# EAGLE board ACB Jr. (EAGLE 8.6.3), part 1 of 2
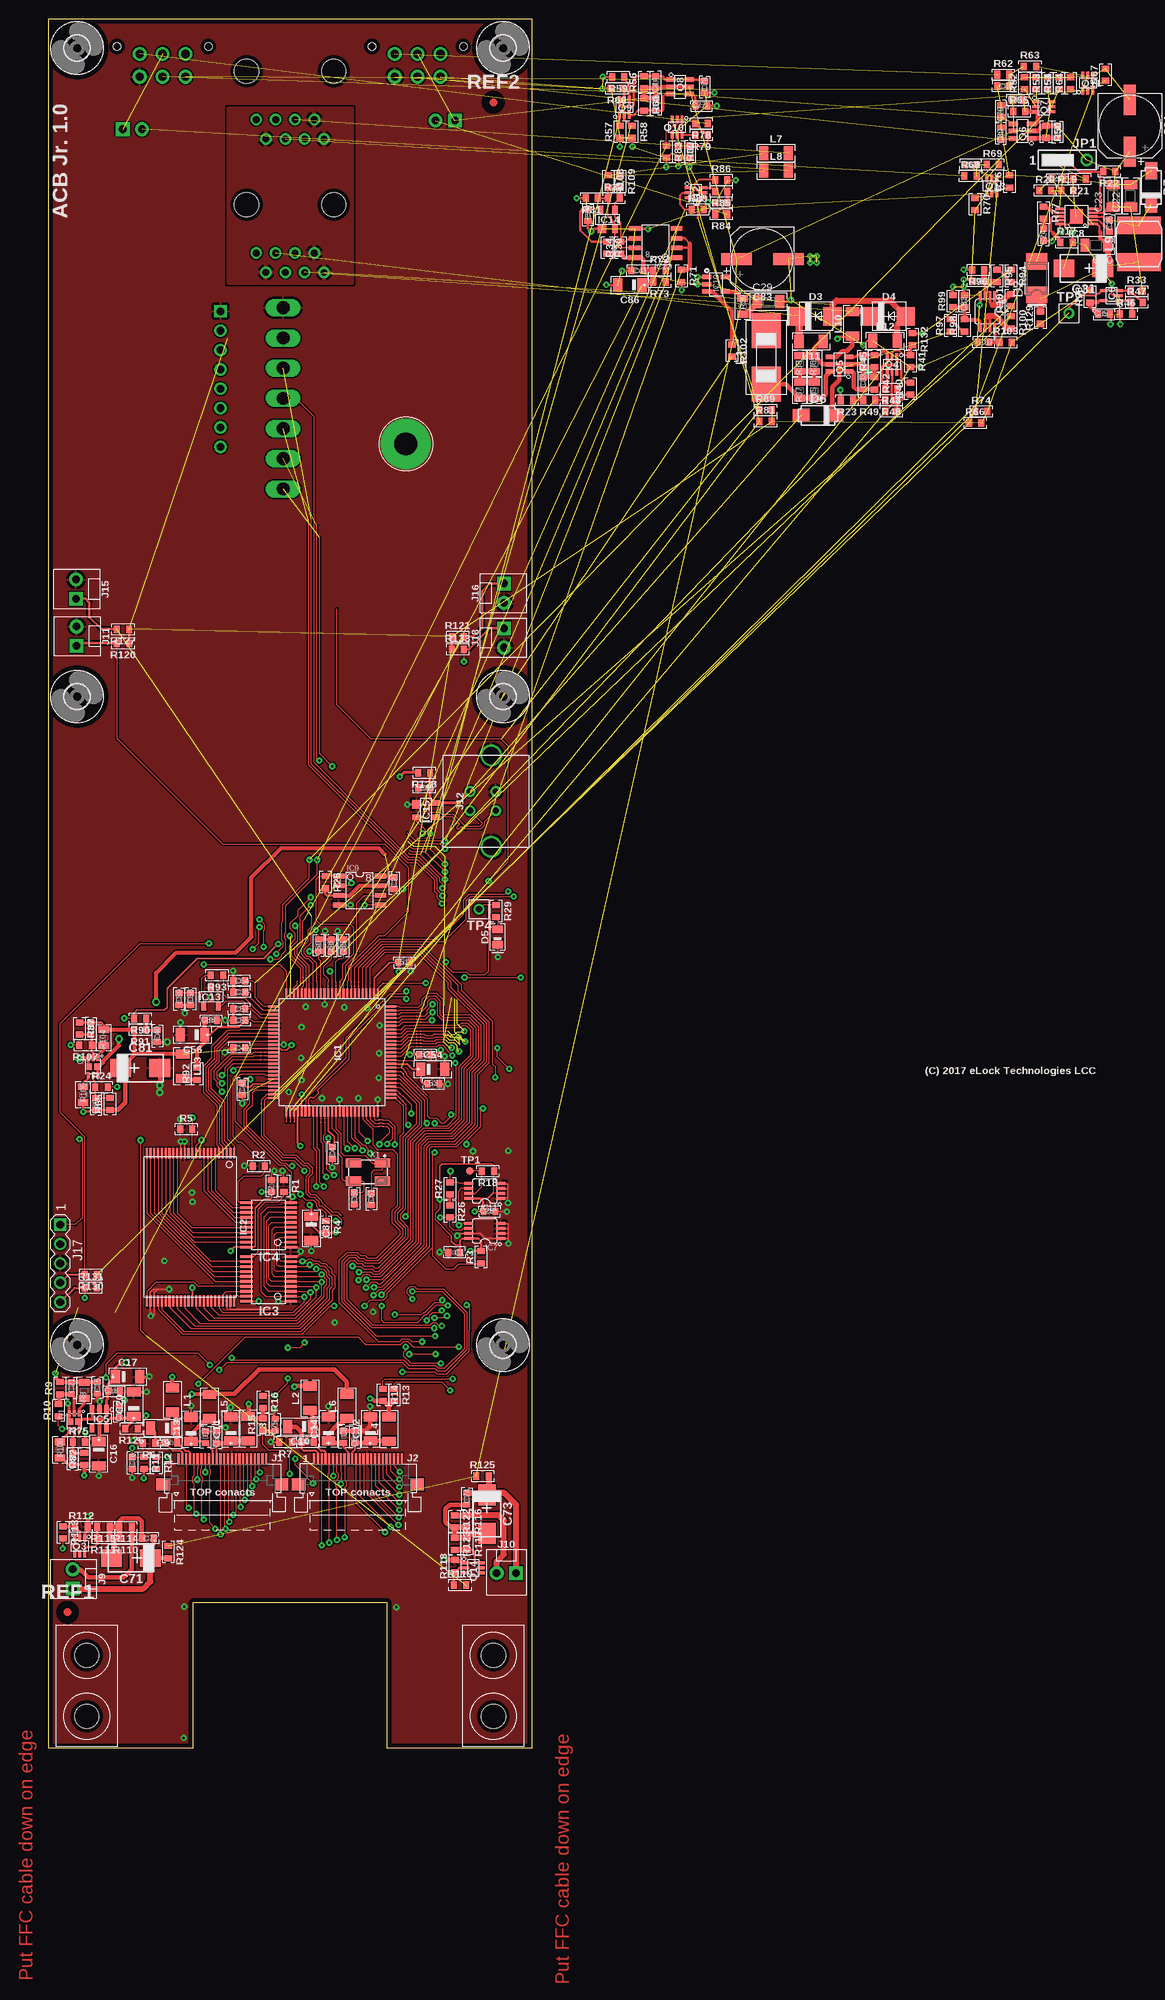
[diagram p6: board, top side]
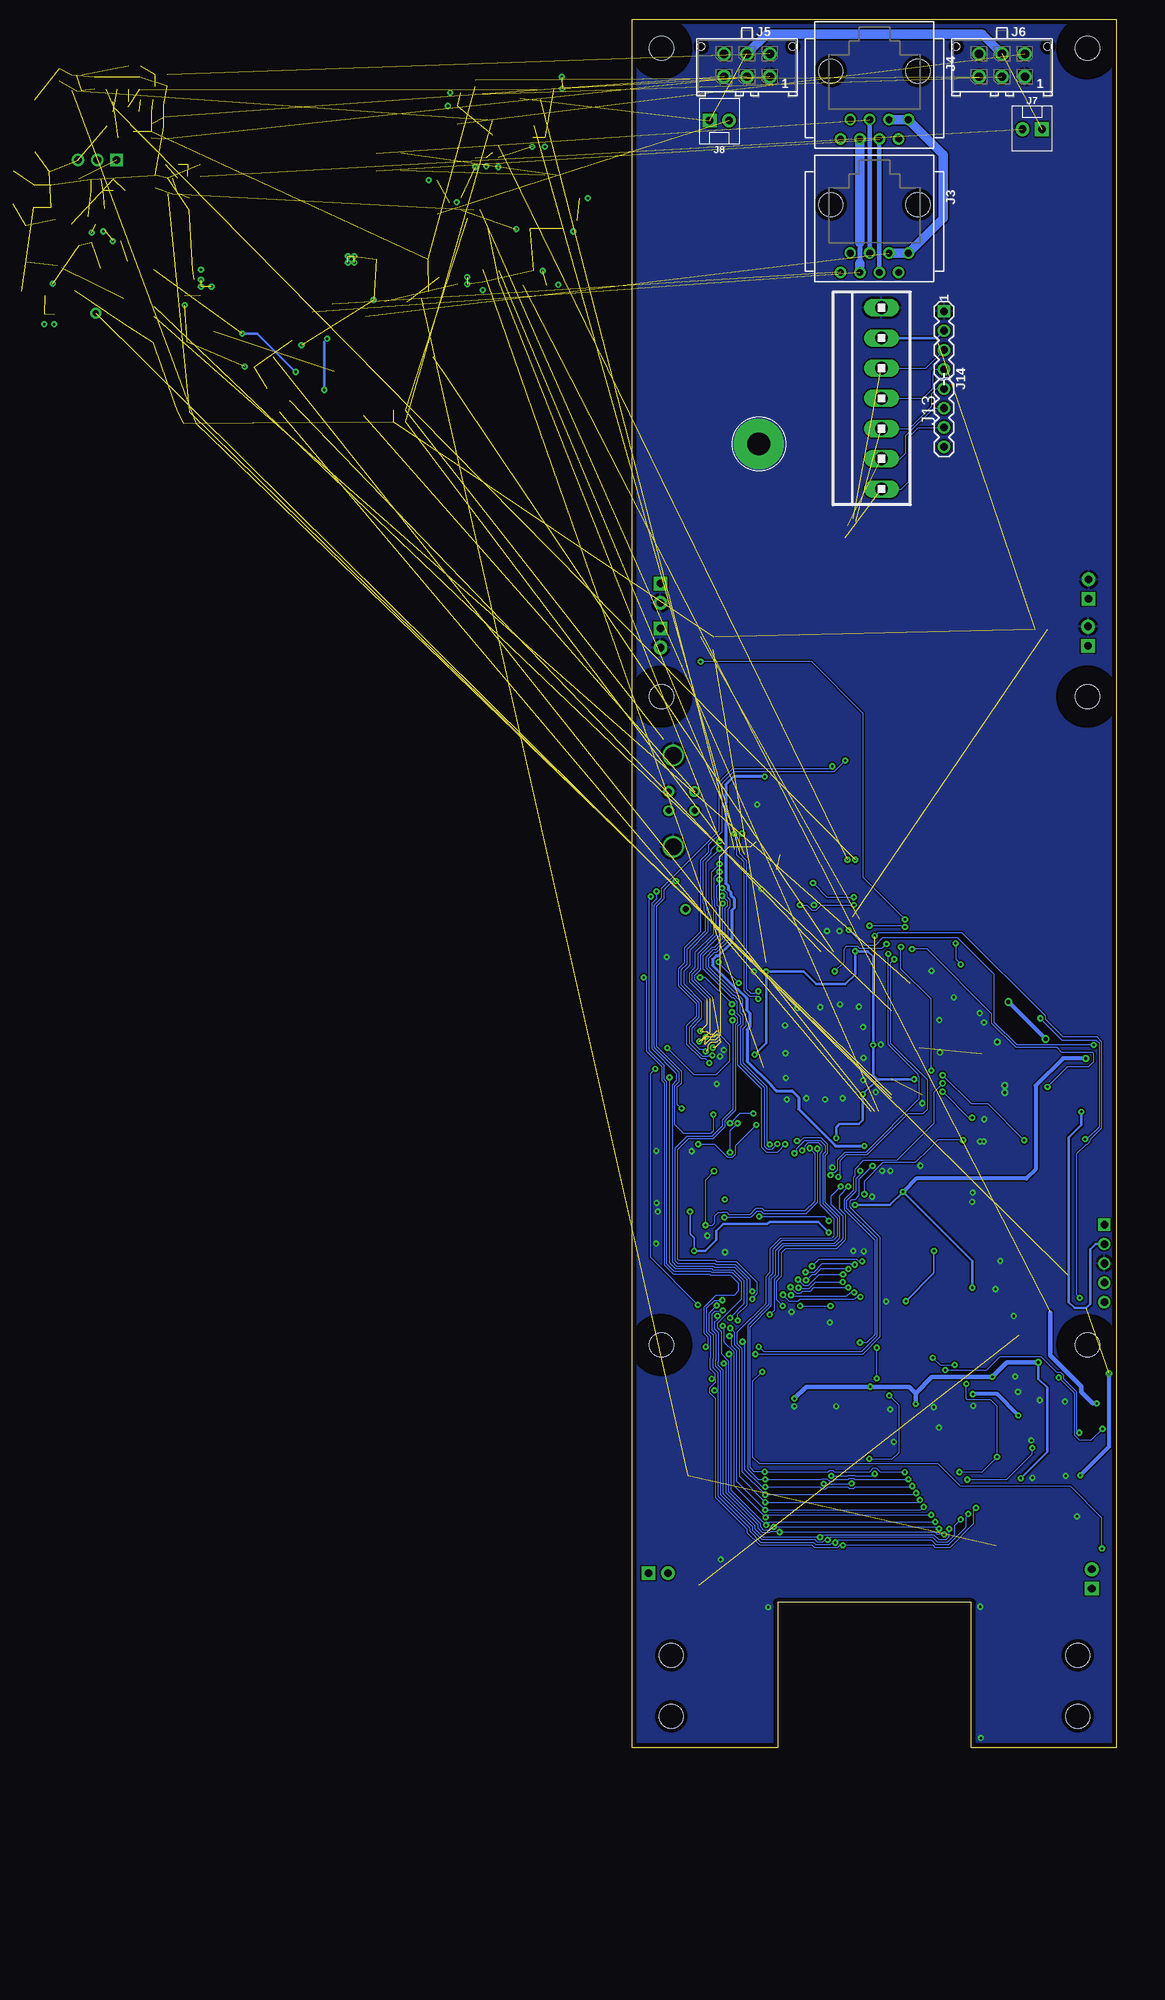
[diagram p7: board, bottom side, seen from below]

Size 63.5 x 226.82 mm. Coordinates in mm from the lower left corner, seen from the top.
Outline: 63.5,0 63.5,226.82 0,226.82 0,0 19.05,0 19.05,19.05 44.45,19.05 44.45,0 63.5,0
Copper layers (1*16): Top 0.035mm / dielectric 1.5mm / Bottom 0.035mm
Design rules "default *": minimum track width 6mil, minimum drill 0.3mm, track to track 0.2mm, track to pad 0.2mm, pad to pad 0.2mm, via to via 0.2mm, smd to smd 0.001mm, copper to edge 0.5mm, drill to drill 0.2mm, minimum pad ring 0.3mm, minimum via ring 0.25mm, stop-mask expansion 0.1mm, vias tented up to drill 0.6mm, thermal gap 0.35mm
Net classes: 1 HV: clearance 0.3 mm to class 0
tKeepout: area 16.6,19.1 to 46.9,32.5; 2 lines
tRestrict: 34 lines

## Footprints (pad centres in the part's own frame; a part is rotated, then mirrored left to right if it is on the bottom)
0603 = smd 0.762 x 0.965: 1 -0.787,0; 2 0.787,0
1206-POL-C = smd 1.19 x 1.79: + -1.6,0; - 1.6,0
1206 = smd 1.143 x 1.702: 1 -1.473,0; 2 1.473,0
CT-C = smd 2.743 x 2.311: + -2.54,0; - 2.54,0
CAP_8MM_DIA_SMT = smd 1.59 x 3.99: 1 0,3.4; 2 0,-3.4
SMA = smd 2.159 x 2.743: + -2.311,0.003; - 2.108,-0.002
SMB@1 = smd 2.4 x 2.4: A 2.2,0; C -2.2,0
0805-POL-D = smd 0.99 x 1.39: A 1,0; K -1,0
SMA' = smd 2.21 x 1.575: A -2.223,0; K 2.223,0
LITTLEFUSE0154 = smd 4.6 x 3.8: 1 3.5,0; 2 -3.5,0
CAM-HOLDER = hole 3.2: 0,4; 0,-4
3,2 = hole 3.2: 0,0
TQFP100_14X14_0,5MM = smd 1.39 x 0.28: 1 -7.7,6; 2 -7.7,5.5; 3 -7.7,5; 4 -7.7,4.5; 5 -7.7,4; 6 -7.7,3.5; 7 -7.7,3; 8 -7.7,2.5; 9 -7.7,2; 10 -7.7,1.5; 11 -7.7,1; 12 -7.7,0.5; 13 -7.7,0; 14 -7.7,-0.5; 15 -7.7,-1; 16 -7.7,-1.5; 17 -7.7,-2; 18 -7.7,-2.5; 19 -7.7,-3; 20 -7.7,-3.5; 21 -7.7,-4; 22 -7.7,-4.5; 23 -7.7,-5; 24 -7.7,-5.5; 25 -7.7,-6; 51 7.7,-6; 52 7.7,-5.5; 53 7.7,-5; 54 7.7,-4.5; 55 7.7,-4; 56 7.7,-3.5; 57 7.7,-3; 58 7.7,-2.5; 59 7.7,-2; 60 7.7,-1.5; 61 7.7,-1; 62 7.7,-0.5; 63 7.7,0; 64 7.7,0.5; 65 7.7,1; 66 7.7,1.5; 67 7.7,2; 68 7.7,2.5; 69 7.7,3; 70 7.7,3.5; 71 7.7,4; 72 7.7,4.5; 73 7.7,5; 74 7.7,5.5; 75 7.7,6 | smd 0.28 x 1.39: 26 -6,-7.7; 27 -5.5,-7.7; 28 -5,-7.7; 29 -4.5,-7.7; 30 -4,-7.7; 31 -3.5,-7.7; 32 -3,-7.7; 33 -2.5,-7.7; 34 -2,-7.7; 35 -1.5,-7.7; 36 -1,-7.7; 37 -0.5,-7.7; 38 0,-7.7; 39 0.5,-7.7; 40 1,-7.7; 41 1.5,-7.7; 42 2,-7.7; 43 2.5,-7.7; 44 3,-7.7; 45 3.5,-7.7; 46 4,-7.7; 47 4.5,-7.7; 48 5,-7.7; 49 5.5,-7.7; 50 6,-7.7; 76 6,7.7; 77 5.5,7.7; 78 5,7.7; 79 4.5,7.7; 80 4,7.7; 81 3.5,7.7; 82 3,7.7; 83 2.5,7.7; 84 2,7.7; 85 1.5,7.7; 86 1,7.7; 87 0.5,7.7; 88 0,7.7; 89 -0.5,7.7; 90 -1,7.7; 91 -1.5,7.7; 92 -2,7.7; 93 -2.5,7.7; 94 -3,7.7; 95 -3.5,7.7; 96 -4,7.7; 97 -4.5,7.7; 98 -5,7.7; 99 -5.5,7.7; 100 -6,7.7
48-TSOP-I = smd 1.4 x 0.28: 1 -9.7,5.75; 2 -9.7,5.25; 3 -9.7,4.75; 4 -9.7,4.25; 5 -9.7,3.75; 6 -9.7,3.25; 7 -9.7,2.75; 8 -9.7,2.25; 9 -9.7,1.75; 10 -9.7,1.25; 11 -9.7,0.75; 12 -9.7,0.25; 13 -9.7,-0.25; 14 -9.7,-0.75; 15 -9.7,-1.25; 16 -9.7,-1.75; 17 -9.7,-2.25; 18 -9.7,-2.75; 19 -9.7,-3.25; 20 -9.7,-3.75; 21 -9.7,-4.25; 22 -9.7,-4.75; 23 -9.7,-5.25; 24 -9.7,-5.75; 25 9.7,-5.75; 26 9.7,-5.25; 27 9.7,-4.75; 28 9.7,-4.25; 29 9.7,-3.75; 30 9.7,-3.25; 31 9.7,-2.75; 32 9.7,-2.25; 33 9.7,-1.75; 34 9.7,-1.25; 35 9.7,-0.75; 36 9.7,-0.25; 37 9.7,0.25; 38 9.7,0.75; 39 9.7,1.25; 40 9.7,1.75; 41 9.7,2.25; 42 9.7,2.75; 43 9.7,3.25; 44 9.7,3.75; 45 9.7,4.25; 46 9.7,4.75; 47 9.7,5.25; 48 9.7,5.75
TSSOP20 = smd 1.6 x 0.35: 1 -2.9,2.925; 2 -2.9,2.275; 3 -2.9,1.625; 4 -2.9,0.975; 5 -2.9,0.325; 6 -2.9,-0.325; 7 -2.9,-0.975; 8 -2.9,-1.625; 9 -2.9,-2.275; 10 -2.9,-2.925; 11 2.9,-2.925; 12 2.9,-2.275; 13 2.9,-1.625; 14 2.9,-0.975; 15 2.9,-0.325; 16 2.9,0.325; 17 2.9,0.975; 18 2.9,1.625; 19 2.9,2.275; 20 2.9,2.925
SOT23-5 = smd 0.59 x 1.19: 1 -0.95,-1.2; 2 0,-1.2; 3 0.95,-1.2; 4 0.95,1.2; 5 -0.95,1.2
SC-70-5 = smd 0.39 x 0.99: 1 -0.65,-1; 2 0,-1; 3 0.65,-1; 4 0.65,1; 5 -0.65,1
MSOP-08 = smd 0.38 x 1.2: 1 -1,-2.1; 2 -0.35,-2.1; 3 0.3,-2.1; 4 0.95,-2.1; 5 0.95,2.1; 6 0.3,2.1; 7 -0.35,2.1; 8 -1,2.1
MSOP10EXP = smd 0.3 x 1.2: 1 -1,-2.2; 2 -0.5,-2.2; 3 0,-2.2; 4 0.5,-2.2; 5 1,-2.2; 6 1,2.2; 7 0.5,2.2; 8 0,2.2; 9 -0.5,2.2; 10 -1,2.2 | smd 1.88 x 1.68: EP 0,0
SO-08 = smd 0.61 x 1.524: 1 -1.905,-2.743; 2 -0.635,-2.743; 3 0.635,-2.743; 4 1.905,-2.743; 5 1.905,2.743; 6 0.635,2.743; 7 -0.635,2.743; 8 -1.905,2.743
SOT23-5' = smd 0.6 x 1.2: 1 -0.95,-1.206; 2 0,-1.206; 3 0.95,-1.206; 4 0.95,1.206; 5 -0.95,1.206
SO08 = smd 0.61 x 1.524: 1 -1.905,-2.743; 2 -0.635,-2.743; 3 0.635,-2.743; 4 1.905,-2.743; 5 1.905,2.743; 6 0.635,2.743; 7 -0.635,2.743; 8 -1.905,2.743
SOT23 = smd 0.69 x 1.19: 1 0.95,1.2; 2 -0.95,1.2; 3 0,-1.2
SOT-143 = smd 1.09 x 1.19: 1 -0.75,-1.2 | smd 0.69 x 1.19: 2 0.95,-1.2; 3 0.95,1.2; 4 -0.95,1.2
FH12A-24S-05SH = smd 0.3 x 1.5: 1 -5.75,2.8; 2 -5.25,2.8; 3 -4.75,2.8; 4 -4.25,2.8; 5 -3.75,2.8; 6 -3.25,2.8; 7 -2.75,2.8; 8 -2.25,2.8; 9 -1.75,2.8; 10 -1.25,2.8; 11 -0.75,2.8; 12 -0.25,2.8; 13 0.25,2.8; 14 0.75,2.8; 15 1.25,2.8; 16 1.75,2.8; 17 2.25,2.8; 18 2.75,2.8; 19 3.25,2.8; 20 3.75,2.8; 21 4.25,2.8; 22 4.75,2.8; 23 5.25,2.8; 24 5.75,2.8 | smd 1.8 x 1.6: C1 -7.75,-0.5; C2 7.75,-0.5
RJ8-8-180 = drill 0.9 pad 1.4: 1 -4.445,6.35; 2 -3.175,8.89; 3 -1.905,6.35; 4 -0.635,8.89; 5 0.635,6.35; 6 1.905,8.89; 7 3.175,6.35; 8 4.445,8.89 | hole 3.2: 5.715,0; -5.715,0
MOLEX430450613 = drill 1.1 pad 1.8: 1 3,-1.5; 2 0,-1.5; 3 -3,-1.5; 4 3,1.5; 5 0,1.5; 6 -3,1.5 | hole 1: 6,2.45; -6,2.45
3-641215-2 = drill 1 pad 1.8 square: 1 1.27,0 | drill 1 pad 1.8: 2 -1.27,0
USB_B_180 = drill 0.8 pad 1.4: 1_+5V 1.25,2.8; 2_D- -1.25,2.8; 3_D+ -1.25,-0.6; 4_GND 1.25,-0.6 | drill 2.2 pad 2.8: SH1 -6,0; SH2 6,0
1X7MTA = drill 1.676 long: 1 11.887,0; 2 7.925,0; 3 3.962,0; 4 0,0; 5 -3.962,0; 6 -7.925,0; 7 -11.887,0
MA08-1-MALE = drill 1 pad 1.6 square: 1 -8.89,0 | drill 1 pad 1.6: 2 -6.35,0; 3 -3.81,0; 4 -1.27,0; 5 1.27,0; 6 3.81,0; 7 6.35,0; 8 8.89,0
MA05-1 = drill 1 pad 1.6 square: 1 -5.08,0 | drill 1 pad 1.6: 2 -2.54,0; 3 0,0; 4 2.54,0; 5 5.08,0
JP3CLOSE12 = drill 1 pad 1.626 square: 1 -2.54,0 | drill 1 pad 1.626: 2 0,0; 3 2.54,0
1206@1 = smd 1.19 x 1.79: 1 -1.6,0; 2 1.6,0
NR6028 = smd 2.3 x 5.7: 1 2.4,0; 2 -2.4,0
TEMP-PAD = smd 0.2 x 0.2: P$1 0,0
BT_MODULE_BRD = drill 3 pad 6.6: 1 25.5,20.5
MICRO_FET = smd 0.4 x 0.8: 1 -0.65,-1.1; 2 0,-1.1; 3 0.65,-1.1; 4 0.65,1.1; 5 0,1.1; 6 -0.65,1.1 | smd 0.7 x 0.86: P1 -0.5,0; P2 0.5,0
SC70-6 = smd 0.39 x 0.99: 1 -0.65,-1; 2 0,-1; 3 0.65,-1; 4 0.65,1; 5 0,1; 6 -0.65,1
SSOT-6 = smd 0.6 x 1.2: 1 -0.95,-1.2; 2 0,-1.2; 3 0.95,-1.206; 4 0.95,1.2; 5 0,1.2; 6 -0.95,1.2
0603@1 = smd 0.79 x 0.99: 1 -0.8,0; 2 0.8,0
0805 = smd 0.9 x 1.4: 1 -1.04,0; 2 1.04,0
SMD_ROUND_1MM = smd 1 x 1: P$1 0,0
TH_ROUND_14MM08MM = drill 0.8 pad 1.4: P$1 0,0
7B = smd 2 x 1.2: 1 -1.9,-1.2; 2 1.9,-1.2; 3 1.9,1.2; 4 -1.9,1.2

## Placement (x,y rotation side)
C1  100n  [0603]  53.3,64.97 180 top
C2  100n  [0603]  29.33,73.72 90 top
C3  100n  [0603]  16.15,40.02 0 top
C4  100n  [0603]  34.08,40.11 0 top
C5  100n  [0603]  22.1,40.72 90 top
C6  100n  [0603]  40.28,40.78 90 top
C7  100n  [0603]  20.63,40.76 270 top
C8  100n  [0603]  38.77,40.78 270 top
C9  10uTA  [1206-POL-C]  15.08,41.92 180 top
C10  10uTA  [1206-POL-C]  33.04,42.12 180 top
C11  10uTA  [1206-POL-C]  23.98,41.83 90 top
C12  10uTA  [1206-POL-C]  42.28,41.83 90 top
C13  10uTA  [1206-POL-C]  18.75,41.77 90 top
C14  10uTA  [1206-POL-C]  36.79,41.83 90 top
C15  10u  [0603]  6.44,47.24 270 top
C16  10uTA  [1206-POL-C]  6.64,38.56 270 top
C17  10uTA  [1206-POL-C]  10.44,48.68 0 top
C18  100n  [0603]  8.64,46.78 0 top
C19  100n  [0603]  9.34,44.08 90 top
C20  10uTA  [1206-POL-C]  11.24,45.08 90 top
C21  1n->10n  [0603]  3.04,47.18 270 top
C22  4u7/50  [1206]  142.01,203.62 90 top  (outside the outline)
C23  4u7/50  [1206]  139.71,203.62 90 top  (outside the outline)
C24  1n  [0603]  130.61,198.52 90 top  (outside the outline)
C25  470n/25  [0603]  139.21,199.72 270 top  (outside the outline)
C26  10p  [0603]  132.41,205.82 0 top  (outside the outline)
C27  100n  [0603]  45.38,113.47 270 top
C28  100n  [0603]  57.9,70.37 0 top
C29  4u7/50  [1206]  94.51,189.72 0 top  (outside the outline)
C30  47u/6.3  [1206]  137.51,197.12 180 top  (outside the outline)
C31  47uTC  [CT-C]  135.81,194.12 180 top  (outside the outline)
C32  100n  [0603]  121.01,207.72 180 top  (outside the outline)
C33  100n  [0603]  106.91,179.02 270 top  (outside the outline)
C34  1n  [0603]  106.91,181.92 90 top  (outside the outline)
C35  100n  [0603]  138.51,188.12 0 top  (outside the outline)
C36  100n  [0603]  25.06,99.14 180 top
C37  100n  [0603]  84.21,209.42 270 top  (outside the outline)
C38  100n  [0603]  88.31,202.72 180 top  (outside the outline)
C39  100n  [0603]  70.81,201.12 270 top  (outside the outline)
C40  100n  [0603]  14.29,93.38 270 top
C41  100n  [0603]  77.31,193.82 180 top  (outside the outline)
C42  100n  [0603]  132.41,212.02 270 top  (outside the outline)
C43  1n  [0603]  127.21,216.22 0 top  (outside the outline)
C44  1n  [0603]  79.71,218.52 90 top  (outside the outline)
C45  100n  [0603]  79.71,215.62 270 top  (outside the outline)
C46  100n  [0603]  125.31,218.02 180 top  (outside the outline)
C47  100n  [0603]  37.28,78.02 270 top
C48  1u  [0603]  25.46,86.44 270 top
C49  100n  [0603]  25.06,91.84 180 top
C50  1u  [0603]  35.52,105.28 90 top
C51  100n  [0603]  46.76,103.04 0 top
C52  1u  [0603]  49.46,90.94 0 top
C53  10u  [0603]  50.56,87.14 0 top
C54  10uTA  [1206-POL-C]  50.46,89.04 0 top
C55  100n  [0603]  25.06,95.44 180 top
C56  10uTA  [1206-POL-C]  18.96,93.54 180 top
C57  100n->10n  [0603]  25.06,96.94 180 top
C58  100n  [0603]  18.66,98.24 270 top
C59  1u->100n  [0603]  17.16,98.24 270 top
C60  18p  [0603]  40.16,72.06 270 top
C61  18p  [0603]  42.37,72.02 270 top
C62  1n  [0603]  122.01,192.42 180 top  (outside the outline)
C63  1n  [0603]  120.21,189.82 90 top  (outside the outline)
C64  100n  [0603]  25.06,100.64 180 top
C65  1n  [0603]  38.77,105.26 90 top
C66  10n  [0603]  37.14,105.26 90 top
C67  10u  [0603]  122.71,184.42 180 top  (outside the outline)
C68  1n->10n  [0603]  5.59,94.38 270 top
C69  1n  [0603]  6.29,84.48 90 top
C70  1n  [0603]  3.24,37.88 90 top
C71  47uTC  [CT-C]  10.86,24.88 180 top
C72  100n  [0603]  13.06,27.48 180 top
C73  47uTC  [CT-C]  57.56,30.64 270 top
C74  100n  [0603]  54.92,32.67 270 top
C75  100n  [0603]  29.79,42.39 90 top
C76  100n  [0603]  11.03,37.37 270 top
C77  100n  [0603]  85.71,215.42 0 top  (outside the outline)
C78  100n  [0603]  86.11,217.92 270 top  (outside the outline)
C79  100n  [0603]  125.01,214.72 90 top  (outside the outline)
C80  100n  [0603]  125.01,211.82 90 top  (outside the outline)
C81  47uTC  [CT-C]  12.09,89.18 0 top
C83  220u/25V  [CAP_8MM_DIA_SMT]  93.71,195.32 90 top  (outside the outline)
C84  220u/25V  [CAP_8MM_DIA_SMT]  141.91,212.82 180 top  (outside the outline)
C85  100n  [0603]  49.35,125.96 180 top
C86  10uTA  [1206-POL-C]  76.31,191.92 180 top  (outside the outline)
C87  10uTA  [1206-POL-C]  34.53,68.12 270 top
C88  10u  [0603]  21.36,95.44 0 top
D2  SMLVT3V3  [SMA]  129.71,192.92 90 top  (outside the outline)
D3  P6SMB20A  [SMB@1]  100.71,187.82 0 top  (outside the outline)
D4  P6SMB20A  [SMB@1]  110.31,187.82 0 top  (outside the outline)
D5  LED-GREEN  [0805-POL-D]  58.97,106.37 90 top
D6  SS14  [SMA']  101.01,174.82 0 top  (outside the outline)
D7  SS14  [SMA']  144.71,204.72 270 top  (outside the outline)
F1  T1A-LITTLEFUSE0154  [LITTLEFUSE0154]  94.21,182.42 90 top  (outside the outline)
H1  CAM-HOLDER  [CAM-HOLDER]  58.42,8.13 0 top
H2  CAM-HOLDER  [CAM-HOLDER]  5.08,8.13 0 top
H3  MOUNT-HOLE3.2  [3,2]  3.81,223.01 0 top
H4  MOUNT-HOLE3.2  [3,2]  59.69,223.01 0 top
H5  MOUNT-HOLE3.2  [3,2]  3.81,137.92 0 top
H6  MOUNT-HOLE3.2  [3,2]  59.69,137.92 0 top
H7  MOUNT-HOLE3.2  [3,2]  3.81,52.83 0 top
H8  MOUNT-HOLE3.2  [3,2]  59.69,52.83 0 top
IC1  PIC32MX470F512L-I/PF  [TQFP100_14X14_0,5MM]  37.26,91.24 270 top
IC2  R1LV1616  [48-TSOP-I]  18.68,68.32 270 top
IC3  74LVC573APW-TSSOP20  [TSSOP20]  28.93,61.5 180 top
IC4  74LVC573APW-TSSOP20  [TSSOP20]  28.93,68.6 180 top
IC5  TLV73315PDBV  [SOT23-5]  6.74,43.16 180 top
IC6  MIC841LYC  [SC-70-5]  139.51,190.52 90 top  (outside the outline)
IC7  24LC32A-I/MS  [MSOP-08]  57.3,67.82 90 top
IC8  LT3971EMSE  [MSOP10EXP]  134.91,200.92 90 top  (outside the outline)
IC9  AT25SF321-SSHD  [SO-08]  40.88,112.47 270 top
IC10  MAX9938HEUK+T  [SOT23-5']  87.61,192.02 270 top  (outside the outline)
IC11  24LC32A-I/MS  [MSOP-08]  57.3,73.07 90 top
IC12  SN65HVD12D  [SO08]  79.71,197.42 90 top  (outside the outline)
IC13  REF3025  [SOT23]  21.36,98.54 180 top
IC14  TPD2E001DZDR  [SOT-143]  73.41,200.52 0 top  (outside the outline)
IC15  TPD2E001DZDR  [SOT-143]  49.59,123.03 270 top
IC16  MCP6042-I/MS  [MSOP-08]  123.21,188.42 180 top  (outside the outline)
J1  FH12A-24S-0.5SH  [FH12A-24S-05SH]  22.86,35.05 0 top
J2  FH12A-24S-0.5SH  [FH12A-24S-05SH]  40.64,35.05 0 top
J3  RJ8-8-180  [RJ8-8-180]  31.75,202.47 180 bottom
J4  RJ8-8-180  [RJ8-8-180]  31.75,219.97 180 bottom
J5  MOLEX430450613  [MOLEX430450613]  48.48,220.76 0 bottom
J6  MOLEX430450613  [MOLEX430450613]  15.02,220.76 0 bottom
J7  3-641215-2  [3-641215-2]  11.06,212.36 0 bottom
J8  3-641215-2  [3-641215-2]  52.1,213.51 180 bottom
J9  3-641215-2  [3-641215-2]  3.24,22.14 270 top
J10  3-641215-2  [3-641215-2]  60.12,22.91 0 top
J11  3-641215-2  [3-641215-2]  3.73,145.85 270 top
J12  USB_A_180  [USB_B_180]  58.14,124.2 90 top
J13  [1X7MTA]  30.84,177.05 90 bottom
J14  pin1x8  [MA08-1-MALE]  22.62,179.58 270 bottom
J15  3-641215-2  [3-641215-2]  3.66,152.02 270 top
J16  3-641215-2  [3-641215-2]  59.82,151.49 90 top
J17  DNP-open-hole  [MA05-1]  1.59,63.54 270 top
J18  3-641215-2  [3-641215-2]  59.82,145.62 90 top
JP1  JP3CLOSE12  [JP3CLOSE12]  133.71,208.32 0 top  (outside the outline)
L1  LQM31PN3R3M00L  [1206@1]  16.32,45.63 270 top
L2  LQM31PN3R3M00L  [1206@1]  34.35,45.84 90 top
L3  LQM31PN3R3M00L  [1206@1]  26.24,41.85 270 top
L4  LQM31PN3R3M00L  [1206@1]  44.72,41.79 90 top
L5  LQM31PN3R3M00L  [1206@1]  21.18,44.78 270 top
L6  LQM31PN3R3M00L  [1206@1]  39.2,44.79 90 top
L7  HI1206T500R  [1206@1]  95.51,209.22 0 top  (outside the outline)
L8  HI1206T500R  [1206@1]  95.51,206.92 0 top  (outside the outline)
L9  NR6028T4R7M  [NR6028]  143.11,197.32 90 top  (outside the outline)
L10  HI1206T500R  [1206@1]  105.51,186.82 90 top  (outside the outline)
L11  HI1206T500R  [1206@1]  100.11,184.52 180 top  (outside the outline)
L12  HI1206T500R  [1206@1]  109.81,184.62 0 top  (outside the outline)
L13  LQM31PN3R3M00L  [1206@1]  17.66,89.44 270 top
O1  PIC-OUT  [TEMP-PAD]  43.56,99.94 270 top
O2  PIC-RPX  [TEMP-PAD]  40.76,99.94 0 top
O3  PIC-RPX  [TEMP-PAD]  40.26,99.94 0 top
O4  PIC-RPX  [TEMP-PAD]  39.76,99.94 0 top
O6  PIC-RPX  [TEMP-PAD]  38.26,99.94 270 top
O7  PIC-RPX  [TEMP-PAD]  37.76,99.94 270 top
O8  PIC-RPX  [TEMP-PAD]  36.75,99.97 270 top
O9  PIC-OUT  [TEMP-PAD]  35.26,100.54 270 top
O12  PIC-RPX  [TEMP-PAD]  33.86,100.54 270 top
O13  PIC-RPX  [TEMP-PAD]  33.06,100.54 270 top
O14  PIC-RPX  [TEMP-PAD]  32.66,100.54 180 top
O15  PIC-RPX  [TEMP-PAD]  28.06,97.54 0 top
O16  PIC-RPX  [TEMP-PAD]  28.06,96.94 270 top
O17  PIC-OUT  [TEMP-PAD]  28.46,91.24 270 top
O18  PIC-RPX  [TEMP-PAD]  28.46,90.74 270 top
O19  PIC-RPX  [TEMP-PAD]  28.46,90.24 270 top
O20  PIC-RPX  [TEMP-PAD]  27.96,84.44 270 top
O21  PIC-RPX  [TEMP-PAD]  28.36,84.44 270 top
O22  PIC-OUT  [TEMP-PAD]  48.36,96.04 270 top
O23  PIC-OUT  [TEMP-PAD]  48.36,95.64 270 top
O24  PIC-OUT  [TEMP-PAD]  48.36,95.24 270 top
O25  PIC-OUT  [TEMP-PAD]  48.36,94.04 270 top
O26  PIC-OUT  [TEMP-PAD]  48.36,93.64 270 top
O27  PIC-RPX  [TEMP-PAD]  48.36,93.24 270 top
O28  PIC-RPX  [TEMP-PAD]  48.36,92.84 270 top
O29  PIC-RPX  [TEMP-PAD]  48.36,92.44 270 top
O30  PIC-RPX  [TEMP-PAD]  48.36,92.04 270 top
O31  PIC-OUT  [TEMP-PAD]  46.56,89.04 270 top
O32  PIC-OUT  [TEMP-PAD]  46.26,88.74 270 top
O33  PIC-RPX  [TEMP-PAD]  46.16,85.84 270 top
O34  PIC-RPX  [TEMP-PAD]  46.16,85.24 270 top
O35  PIC-RPX  [TEMP-PAD]  46.56,84.24 270 top
O36  PIC-RPX  [TEMP-PAD]  43.36,82.34 0 top
O37  PIC-RPX  [TEMP-PAD]  43.36,81.94 0 top
O38  PIC-RPX  [TEMP-PAD]  43.36,81.54 0 top
O39  PIC-OUT  [TEMP-PAD]  36.26,82.59 270 top
O40  PIC-OUT  [TEMP-PAD]  35.76,82.59 270 top
O41  PIC-RPX  [TEMP-PAD]  32.26,82.09 90 top
O42  PIC-RPX  [TEMP-PAD]  31.76,82.64 90 top
O43  PIC-RPX  [TEMP-PAD]  31.26,82.64 270 top
O44  PIC-OUT  [TEMP-PAD]  33.46,100.54 270 top
PCB3  DNP-PCB-BT  [BT_MODULE_BRD]  21.42,191.58 180 bottom
Q1  SSM6P49NU,LFPZ  [MICRO_FET]  3.44,42.78 180 top
Q2  SSM6P49NU,LFPZ  [MICRO_FET]  5.89,89.38 180 top
Q3  FDG6303N  [SC70-6]  4.15,26.47 180 top
Q4  FDG6303N  [SC70-6]  110.71,181.52 180 top  (outside the outline)
Q5  FDC6506P  [SSOT-6]  103.81,181.52 90 top  (outside the outline)
Q6  FDC6506P  [SSOT-6]  127.81,212.12 90 top  (outside the outline)
Q7  FDG6303N  [SC70-6]  130.61,215.32 270 top  (outside the outline)
Q8  FDC6506P  [SSOT-6]  82.91,217.92 270 top  (outside the outline)
Q9  FDG6303N  [SC70-6]  75.61,215.22 0 top  (outside the outline)
Q10  FDG6303N  [SC70-6]  82.51,212.62 180 top  (outside the outline)
Q11  FDG6303N  [SC70-6]  136.41,218.42 0 top  (outside the outline)
Q12  FDG6303N  [SC70-6]  85.01,204.02 270 top  (outside the outline)
Q13  FDG6303N  [SC70-6]  123.81,204.92 0 top  (outside the outline)
Q14  FDG6303N  [SC70-6]  55.76,23.59 270 top
R1  1M  [0603@1]  30.93,73.72 270 top
R2  1M  [0603@1]  27.63,76.32 0 top
R3  1M  [0603@1]  56.8,64.37 90 top
R4  1M  [0603@1]  36.43,68.32 270 top
R5  1M  [0603@1]  18.13,81.12 0 top
R6  0R  [0603@1]  13.25,39.95 180 top
R7  0R  [0603@1]  31.13,40.07 180 top
R8  1R  [0805]  4.74,46.88 90 top
R9  1M  [0603@1]  1.54,47.18 90 top
R10  100k  [0603@1]  1.34,44.28 90 top
R11  10k  [0603@1]  12.56,37.37 270 top
R12  100k  [0603@1]  14.19,37.37 270 top
R13  10k  [0603@1]  45.41,46.3 270 top
R14  10k  [0603@1]  43.91,46.3 270 top
R15  10k  [0603@1]  28.18,42.41 90 top
R16  100k  [0603@1]  28.18,45.37 270 top
R17  47k  [0603@1]  133.61,197.52 0 top  (outside the outline)
R18  10k  [0603@1]  57.7,75.67 180 top
R19  560k  [0603@1]  133.71,204.32 0 top  (outside the outline)
R20  1M  [0603@1]  130.81,204.32 0 top  (outside the outline)
R21  1M  [0603@1]  135.31,205.82 180 top  (outside the outline)
R22  4M99  [0603@1]  139.21,206.82 180 top  (outside the outline)
R23  0R/1M  [0603@1]  104.81,176.82 180 top  (outside the outline)
R24  100k  [0603@1]  6.99,86.68 0 top
R25  1M  [0603@1]  36.38,113.57 270 top
R26  10k  [0603@1]  52.7,70.37 270 top
R27  10k  [0603@1]  52.7,73.37 90 top
R28  100R  [0603@1]  136.71,190.42 90 top  (outside the outline)
R29  300R  [0603@1]  58.77,109.77 270 top
R30  1M  [0603@1]  73.31,196.82 270 top  (outside the outline)
R31  1M  [0603@1]  71.31,203.32 180 top  (outside the outline)
R32  1M  [0603@1]  74.21,203.32 0 top  (outside the outline)
R33  4M99  [0603@1]  142.81,191.12 0 top  (outside the outline)
R34  1M  [0603@1]  75.11,196.82 90 top  (outside the outline)
R35  1k  [0805]  100.51,178.12 90 top  (outside the outline)
R36  1k  [0805]  100.51,181.62 90 top  (outside the outline)
R37  1k  [0805]  98.61,178.12 90 top  (outside the outline)
R38  1k  [0805]  98.61,181.62 90 top  (outside the outline)
R39  0.025R  [0805]  91.11,189.12 270 top  (outside the outline)
R40  300k  [0603@1]  113.11,178.32 90 top  (outside the outline)
R41  1M  [0603@1]  113.11,181.92 270 top  (outside the outline)
R42  1M  [0603@1]  108.41,179.02 270 top  (outside the outline)
R43  300k  [0603@1]  110.61,178.32 180 top  (outside the outline)
R44  1M  [0603@1]  110.61,175.32 0 top  (outside the outline)
R45  1M  [0603@1]  108.41,181.92 90 top  (outside the outline)
R46  560k  [0603@1]  141.41,188.12 0 top  (outside the outline)
R47  100k  [0603@1]  142.81,189.62 0 top  (outside the outline)
R48  1M  [0603@1]  110.61,176.82 180 top  (outside the outline)
R49  1M  [0603@1]  107.71,176.82 180 top  (outside the outline)
R50  1M  [0603@1]  130.91,212.02 270 top  (outside the outline)
R51  300k  [0603@1]  129.61,218.42 270 top  (outside the outline)
R52  1M  [0603@1]  128.11,218.42 90 top  (outside the outline)
R53  300k  [0603@1]  131.11,218.42 90 top  (outside the outline)
R54  1M  [0603@1]  132.61,218.42 90 top  (outside the outline)
R55  1M  [0603@1]  127.41,214.72 0 top  (outside the outline)
R56  1M  [0603@1]  78.21,218.52 90 top  (outside the outline)
R57  300k  [0603@1]  75.01,212.02 90 top  (outside the outline)
R58  1M  [0603@1]  76.61,212.02 270 top  (outside the outline)
R59  300k  [0603@1]  74.81,219.22 180 top  (outside the outline)
R60  1M  [0603@1]  74.61,217.72 180 top  (outside the outline)
R61  1M  [0603@1]  78.21,215.62 270 top  (outside the outline)
R62  100R  [0603@1]  125.31,219.52 0 top  (outside the outline)
R63  1k->4k7  [0603@1]  128.81,220.62 0 top  (outside the outline)
R64  1k  [0603@1]  134.11,218.42 90 top  (outside the outline)
R65  1M  [0603@1]  8.09,84.48 90 top
R66  100k  [0603@1]  121.61,173.82 0 top  (outside the outline)
R67  1M  [0603@1]  138.71,219.52 90 top  (outside the outline)
R68  100R  [0603@1]  121.01,206.22 0 top  (outside the outline)
R69  1k->4k7  [0603@1]  123.91,207.72 0 top  (outside the outline)
R70  1k  [0603@1]  121.61,202.52 270 top  (outside the outline)
R71  10k  [0603@1]  83.11,193.12 270 top  (outside the outline)
R72  1M  [0603@1]  80.21,193.82 0 top  (outside the outline)
R73  1M  [0603@1]  80.21,192.32 180 top  (outside the outline)
R74  100k  [0603@1]  122.41,175.32 0 top  (outside the outline)
R75  100k  [0603@1]  4.04,40.08 0 top
R76  1M  [0603@1]  126.11,205.52 90 top  (outside the outline)
R77  47k  [0603@1]  130.61,201.42 270 top  (outside the outline)
R78  100R  [0603@1]  85.71,213.12 180 top  (outside the outline)
R79  1k->4k7  [0603@1]  85.71,211.62 180 top  (outside the outline)
R80  1k  [0603@1]  82.71,209.42 270 top  (outside the outline)
R81  100k  [0603@1]  94.11,174.02 0 top  (outside the outline)
R82  1M  [0603@1]  4.74,37.88 90 top
R83  1M  [0603@1]  81.11,209.42 270 top  (outside the outline)
R84  100R  [0603@1]  88.31,201.22 180 top  (outside the outline)
R85  1k->4k7  [0603@1]  88.31,204.22 180 top  (outside the outline)
R86  1k  [0603@1]  88.31,205.72 0 top  (outside the outline)
R87  1M  [0603@1]  4.09,94.38 270 top
R88  1M  [0603@1]  85.21,201.82 0 top  (outside the outline)
R89  100k  [0603@1]  94.11,175.52 0 top  (outside the outline)
R90  1k  [0603@1]  12.09,95.68 180 top
R91  10k  [0603@1]  12.09,94.18 180 top
R92  10R  [0603@1]  19.56,88.44 90 top
R93  300R  [0603@1]  22.16,101.34 180 top
R94  180k  [0603@1]  126.31,193.12 270 top  (outside the outline)
R95  4M99  [0603@1]  124.51,193.12 270 top  (outside the outline)
R96  560k  [0603@1]  122.01,193.92 180 top  (outside the outline)
R97  180k  [0603@1]  118.41,186.62 90 top  (outside the outline)
R98  4M99  [0603@1]  120.21,186.62 90 top  (outside the outline)
R99  560k  [0603@1]  118.71,189.82 90 top  (outside the outline)
R100  2k2  [0603@1]  126.31,187.02 270 top  (outside the outline)
R101  2k2  [0603@1]  126.31,189.92 90 top  (outside the outline)
R102  1k  [0603@1]  89.71,183.32 270 top  (outside the outline)
R103  300R  [0603@1]  125.61,184.42 0 top  (outside the outline)
R104  1R  [0805]  7.29,93.18 90 top
R105  1R  [0805]  4.59,85.68 270 top
R106  1R  [0805]  1.54,39.08 270 top
R107  100k  [0603@1]  4.89,92.18 180 top
R108  10R->1R->0R  [0603@1]  73.51,205.52 270 top  (outside the outline)
R109  10R->1R->0R  [0603@1]  75.01,205.52 270 top  (outside the outline)
R110  100R  [0603@1]  10.16,27.48 180 top
R111  100R  [0603@1]  7.26,27.48 180 top
R112  1M  [0603@1]  4.37,28.97 0 top
R113  100R  [0603@1]  1.94,28.24 270 top
R114  100R  [0603@1]  10.16,28.98 180 top
R115  100R  [0603@1]  7.26,28.98 180 top
R116  100R  [0603@1]  54.86,29.69 270 top
R117  100R  [0603@1]  54.92,26.76 270 top
R118  1M  [0603@1]  53.36,23.83 90 top
R119  100R  [0603@1]  54.03,21.32 0 top
R120  100R  [0603@1]  9.83,144.93 180 top
R121  100R  [0603@1]  53.72,145.77 0 top
R122  100R  [0603@1]  53.34,29.69 270 top
R123  100R  [0603@1]  53.34,26.76 270 top
R124  0R  [0603@1]  15.76,25.67 270 top
R125  0R  [0603@1]  57,35.64 0 top
R126  0R  [0603@1]  10.94,41.88 180 top
R127  100R  [0603@1]  9.83,146.76 180 top
R128  10k  [0603@1]  49.35,127.94 180 top
R129  DNP/0R  [0603@1]  130.21,187.62 90 top  (outside the outline)
R130  100k  [0603@1]  5.61,62.06 180 top
R131  100k  [0603@1]  5.61,60.35 0 top
R132  1M  [0603@1]  113.41,184.82 270 top  (outside the outline)
R133  100R  [0603@1]  53.72,144.09 0 top
REF1  REF  [REF]  2.54,17.78 0 top
REF2  REF  [REF]  58.42,215.9 0 top
T1  PIC-OUT  [TEMP-PAD]  36.26,82.04 270 top
T2  PIC-OUT  [TEMP-PAD]  48.91,93.64 270 top
T3  PIC-RPX  [TEMP-PAD]  37.76,100.49 90 top
T4  PIC-OUT  [TEMP-PAD]  48.91,94.04 180 top
T5  PIC-OUT  [TEMP-PAD]  31.76,82.09 90 top
T6  PIC-OUT  [TEMP-PAD]  35.76,82.04 90 top
T7  PIC-OUT  [TEMP-PAD]  32.26,82.64 90 top
T8  PIC-OUT  [TEMP-PAD]  31.26,82.09 90 top
T9  PIC-RPX  [TEMP-PAD]  48.91,92.84 90 top
T10  PIC-RPX  [TEMP-PAD]  27.96,83.89 270 top
T11  PIC-RPX  [TEMP-PAD]  46.56,84.84 270 top
T12  PIC-RPX  [TEMP-PAD]  28.36,83.89 270 top
T13  PIC-RPX  [TEMP-PAD]  48.91,92.44 270 top
T14  PIC-RPX  [TEMP-PAD]  48.91,92.04 180 top
T15  PIC-OUT  [TEMP-PAD]  46.91,88.69 180 top
T16  PIC-RPX  [TEMP-PAD]  40.26,100.49 0 top
T17  PIC-RPX  [TEMP-PAD]  46.16,84.64 180 top
T18  PIC-RPX  [TEMP-PAD]  40.76,100.49 180 top
T19  PIC-RPX  [TEMP-PAD]  39.76,100.49 270 top
T20  PIC-OUT  [TEMP-PAD]  48.91,96.04 90 top
T21  PIC-OUT  [TEMP-PAD]  27.91,90.74 180 top
T27  PIC-OUT  [TEMP-PAD]  38.26,100.49 180 top
T28  PIC-OUT  [TEMP-PAD]  27.91,91.24 180 top
T30  PIC-OUT  [TEMP-PAD]  48.91,95.24 90 top
T31  PIC-OUT  [TEMP-PAD]  35.26,101.09 180 top
T32  PIC-OUT  [TEMP-PAD]  33.46,101.09 180 top
T33  PIC-OUT  [TEMP-PAD]  48.91,95.64 180 top
T34  PIC-RPX  [TEMP-PAD]  48.91,93.24 90 top
T35  PIC-RPX  [TEMP-PAD]  27.91,90.24 180 top
T36  PIC-OUT  [TEMP-PAD]  43.96,100.34 270 top
T37  PIN-AN  [TEMP-PAD]  27.66,97.94 270 top
T38  PIN-AN  [TEMP-PAD]  27.66,97.34 180 top
T39  PIN-AN  [TEMP-PAD]  36.75,100.51 180 top
T40  PIC-RPX  [TEMP-PAD]  43.91,81.94 0 top
T41  PIC-RPX  [TEMP-PAD]  43.91,82.34 0 top
T42  PIC-OUT  [TEMP-PAD]  43.91,81.54 180 top
T43  PIC-RPX  [TEMP-PAD]  46.56,85.44 270 top
T44  PIC-OUT  [TEMP-PAD]  46.61,88.39 180 top
T45  PIC-RPX  [TEMP-PAD]  137.81,190.82 180 top  (outside the outline)
TP1  DNP-TestPoint  [SMD_ROUND_1MM]  55.3,75.67 0 top
TP2  DNP-TestPoint  [TH_ROUND_14MM08MM]  133.91,188.22 0 top  (outside the outline)
TP4  DNP-TestPoint  [TH_ROUND_14MM08MM]  56.53,110.03 180 top
X1  8MHz-5x3.2mm  [7B]  41.96,75.54 180 top

## Tracks (layer width: path | path; a pad name or v marks a point on that pad's centre or on a via)
1.5V-CAM  (via drill 0.3)
  Top 0.254: R126.1 12.56,42.7 12.56,42.95 12.86,43.25 v12.86,43.59
  Top 0.508: v18.84,46.39 21.16,46.39 L5.1
  Top 0.61: L5.1 24.45,46.39 27.68,49.62 37.55,49.62 39.2,47.98 L6.2
  Bottom 0.508: v12.86,43.59 15.67,46.39 v18.84,46.39
1.5V-CAM-OUT
  Top 0.406: IC5.5 7.69,42.74 8.24,43.29 C19.1 11.05,43.29 | 11.05,43.29 C20.+ | R126.2 11.05,42.79 11.05,43.29
3.3V/CAM  (via drill 0.3, 0.41)
  Top 0.305: R12.2 R11.2 v12.56,35.36 | v12.56,35.36
  Top 0.406: Q1.P1 4.09,42.63 | 4.09,42.63 Q1.6 | 4.09,42.63 4.56,43.1 5.79,43.1 | 5.79,43.1 6.77,43.1 7.19,43.1 7.69,43.6 IC5.1 7.69,45.61 7.85,45.77 C18.1 7.85,47.69 C17.+ 8.84,49.81 9.57,50.54 v10.24,50.54 | IC5.3 5.79,43.1 | 5.79,43.1
  Top 0.508: C16.+ 6.77,40.28 6.77,43.1
  Top 0.61: R16.2 R15.2 26.48,43.21 L3.1 26.34,43.55 v26.34,45.11 | 9.08,48.92 C17.+ | L2.2 32.38,47.44 v32.31,47.37 | L4.2 44.72,44.8 | 44.72,44.8 R13.2 | 44.72,44.8 44.02,45.5 R14.2 42.83,45.5 42.62,45.71 42.34,45.71 v42.24,45.81 | L1.1 16.32,48.61 v16.28,48.65
  Bottom 0.305: v12.56,35.36 9.08,38.83 9.08,47.24 10.24,48.4 v10.24,50.54
  Bottom 0.61: 26.34,46.51 v26.34,45.11 | 26.34,46.51 24.2,48.65 v16.28,48.65 14.39,50.54 v10.24,50.54 | 26.34,46.51 27.19,47.37 v32.31,47.37 40.69,47.37 v42.24,45.81
+3,3V-FILT
  Top 0.356: IC6.5 137.9,189.87 137.69,189.66
  Top 0.508: 137.69,189.66 137.65,189.62 R28.1 136.71,189.13 C35.1
+3.3V  (via drill 0.3)  (12 unrouted)
  Top 0.152: C50.1 35.52,103.46 35.76,103.22 IC1.16 | IC1.86 45.76,90.24 45.84,90.15 48.07,90.15 48.67,90.75 C52.1
  Top 0.203: C49.1 26.44,91.84 26.54,91.74 IC1.37 30.44,91.74 30.63,91.54 31.29,91.54 v31.92,92.18 | 25.47,87.24 C48.1 25.96,86.72 26.52,86.72 26.91,87.11 28.59,87.11 28.71,87.24 IC1.46 | IC1.2 42.76,100.97 44.83,103.04 C51.1 | IC1.62 36.76,80.95 37.53,80.18 37.53,79.06 C47.1 36.77,79.32 v36.77,79.99
  Top 0.254: IC1.55 33.26,85.72 v33.27,85.73
  Top 0.305: C50.1 v34.3,104.49 v34.29,104.5 | R105.2 v4.59,83.44 | v4.59,83.44 v4.6,83.44 | C51.1 v45.97,101.83 | C48.1 25.94,87.71 v26.54,87.71 | C52.1 v47.48,90.94 v47.48,90.93 | R65.1 6.31,83.68 C69.1 5.6,83.69 5.39,83.48 4.64,83.48 v4.59,83.44 | R87.1 C68.1 6.94,95.17 7.29,94.81 R104.2
  Top 0.356: R127.1 R120.1 | R121.1 R133.1
  Top 0.406: R82.1 3.25,37.08 C70.1 2.71,37.09 1.76,38.04 R106.2
  Top 0.508: C15.1 4.85,48.02 R8.2 4.69,47.97 C21.1 3.03,47.98 R9.2 0.98,48.55 v0.98,49.13 | R82.1 4.74,35.74 v4.75,35.72 | L13.1 11.41,91.04 | 11.41,91.04 C81.+ | 11.41,91.04 11.29,91.15 R91.2 7.33,94.18 R104.2
  Top 0.61: R65.1 9.15,83.68 10.13,84.66 10.13,88.6 C81.+
  Bottom 0.305: v26.54,87.71 31.33,87.71 | 31.33,87.71 33.27,85.77 v33.27,85.73 33.27,82.37 33.83,81.81 36.34,81.81 36.77,81.38 v36.77,79.99 | 31.33,87.71 31.92,88.3 v31.92,92.18 31.92,103.82 32.61,104.5 v34.29,104.5 34.29,101.47 35.59,100.18 39.37,100.18 41.02,101.83 v45.97,101.83 | v47.48,90.93 45.97,92.43 v45.97,101.83 | v45.97,101.83 | J17.2 2.72,66.08 3.43,65.38 3.43,58.22 3.96,57.68 5.49,57.68 6.25,58.45 6.25,80.09 4.6,81.73 v4.6,83.44
  Bottom 0.356: J13.2 23.57,184.98 J14.2
  Bottom 0.508: v4.75,35.72 0.98,39.5 v0.98,49.13
+3.3V/1  (via drill 0.3, 0.41)
  Top 0.152: IC11.2 58.64,72.72 58.48,72.88 58.48,75.65 R18.1 | v51.37,71.92 51.37,70.7 50.76,70.08 50.76,69.29 52.91,67.14 52.91,67
  Top 0.203: v28,72.94 C2.1 29.33,72.19 29.34,72.18 29.14,71.98 28.36,71.98 27.18,70.8 27.18,65.82 27.03,65.67 IC4.20 24.42,65.67 v23.94,65.19 | IC3.20 27.61,58.57 v27.62,58.59 | 52.7,71.99 52.64,71.92 v51.37,71.92 51.37,76.3 51.69,76.62 58.23,76.62 58.5,76.35 R18.1 | C28.1 55.98,70.37 v55.94,70.33 | 58.48,72.88 57.67,72.07 56.33,72.07 | 54.09,65.95 53.4,65.95 52.91,66.44 52.91,67 52.91,67.1
  Top 0.254: C1.1 54.09,65.95 54.09,66.57 54.33,66.82 IC7.8 | C87.+ 34.53,68.64 35.64,67.52 R4.2 | v18.92,60.36 IC2.37
  Top 0.305: R26.1 52.7,71.99 R27.1 | C28.1 57.11,71.58 56.62,72.07 56.33,72.07 IC11.8 | IC7.8 56.41,66.82 56.8,66.43 R3.2 v55.41,65.17 | Q2.3 5.25,89.53 Q2.P2 | v34.3,71.22 34.53,71 C87.+ | v37.73,67.61 37.65,67.52 R4.2
  Top 0.406: Q2.3 4.07,90.48 v4.04,90.45
  Bottom 0.203: v27.62,58.59 23.94,62.27 v23.94,65.19 | v55.94,70.33 55.94,67.41 55.41,66.88 v55.41,65.17
  Bottom 0.305: v34.3,71.22 29.72,71.22 v28,72.94 18.92,63.86 v18.92,60.36 | v55.41,65.17 53.95,65.17 52.49,66.63 52.49,67.79 51.57,68.7 45.78,68.7 45.48,69.01 39.14,69.01 v37.73,67.61
  Bottom 0.508: v28,72.94 26.27,74.68 11.81,74.68 10.59,75.89 10.59,86.87 7.01,90.45 v4.04,90.45
+3.3V/2  (via drill 0.3)  (1 unrouted)
  Top 0.406: Q1.P2 2.79,42.93 Q1.3 | Q1.3 2.79,44.15 | Q1.3 2.79,44.99 v2.59,45.19
  Top 0.61: C41.1 78.09,195.24 77.82,195.51 IC12.8 75.61,195.51 R34.1 R30.2
  Top 0.762: C86.+ 78.31,192.32 R73.2 R72.1 C41.1
  Bottom 0.61: 8.72,57.12 8.72,51.48 4.64,47.4 4.64,46.7 3.12,45.19 v2.59,45.19
+3.3V/VPS  (via drill 0.51)  (1 unrouted)
  Top 0.305: IC9.8 44.64,114.37 | 44.64,114.37 45.27,114.37 C27.1 | IC9.7 44.44,113.1 44.69,113.35 44.69,114.33 44.64,114.37 | 44.64,114.37 44.64,115.22 | Q2.6 6.54,89.23 Q2.P1 | IC9.3 36.55,111.83 36.38,111.99 R25.2
  Top 0.508: IC9.3 39.59,111.83 40.86,113.1 IC9.7 | Q2.P1 6.69,89.38 7.2,89.89 7.2,90.03 9.3,92.13 v9.3,92.98 | v14.17,97.84 14.17,101.65 16.84,104.32 24.61,104.32 26.67,106.38 26.67,114.15 30.56,118.03 43.36,118.03 44.2,117.2
  Bottom 0.508: v9.3,92.98 14.15,97.84 v14.17,97.84
/3.3V1PWRON  (via drill 0.3)
  Top 0.152: IC1.21 33.26,99.74 33.46,99.94 O44.P$1 T32.P$1 33.46,102.38 31.98,103.86 31.98,105.13 32.73,105.89 32.73,107.84 32.72,107.84 v32.4,107.84 | v9.05,86.72 7.83,86.72 R24.2 | v26.82,104.78 27.66,105.61 27.66,107.59 v27.74,107.67
  Bottom 0.152: v9.05,86.72 6.39,89.38 3.66,89.38 2.97,90.07 2.97,91.06 3.12,91.21 7.16,91.21 7.8,91.85 13.18,91.85 16.35,95.03 16.35,96.29 24.84,104.78 v26.82,104.78 | v27.74,107.67 27.91,107.84 v32.4,107.84
/3.3V2PWRON  (via drill 0.3, 0.35)
  Top 0.152: IC1.96 46.04,95.24 46.44,95.64 O23.P$1 T33.P$1 49.53,95.64 50.06,96.17 50.07,96.17 v50.42,96.52 | v47.79,58.86 47.79,58.91 47.11,59.58 47.11,60.14 47.51,60.54 48.07,60.54 48.39,60.22 51.84,60.22 52.7,59.35 | 52.7,59.35 | 52.7,59.35 | 52.7,59.35 54.92,57.14 54.92,52.18 52.13,49.4 51.11,49.4 50.78,49.72 47.32,49.72 46.55,50.49 23.4,50.49 v22.47,49.55
  Top 0.356: R75.2 4.84,41.28 v4.9,41.33
  Bottom 0.152: v47.79,58.86 47.79,58.91 47.11,59.58 47.11,61.03 49.84,63.76 52.41,63.76 52.57,63.92 57.42,63.92 57.57,64.07 57.57,78.49 56.2,79.86 52.96,79.86 51.37,81.44 51.37,82.21 50,83.58 50,94.83 49.65,95.17 49.65,95.76 50.06,96.17 50.07,96.17 v50.42,96.52 | v22.47,49.55 17.02,49.55 15.3,51.27 9.88,51.27 7.85,49.24 7.3,49.24 6.9,48.84 6.9,48.39 5.22,46.7 5.22,41.66 v4.9,41.33
/CAM-PWRON  (via drill 0.3, 0.35)
  Top 0.152: IC1.95 46.03,94.74 46.53,95.24 O24.P$1 T30.P$1 50.13,95.24 v50.35,95.47 | v47.79,59.86 51.69,59.86 54.56,56.99 54.56,52.33 51.99,49.75 51.25,49.75 50.93,50.07 47.47,50.07 46.7,50.84 24.4,50.84 v24.08,51.16 | v21.23,50.23 19.7,51.76 9.03,51.76 7.58,50.31 v7.58,48.56 | v1.83,41.82 1.34,42.31 R10.1
  Bottom 0.152: v47.79,59.86 48.11,60.19 48.11,61.53 49.98,63.41 52.56,63.41 52.72,63.57 57.57,63.57 57.92,63.92 57.92,78.63 56.35,80.21 53.1,80.21 51.73,81.59 51.73,82.36 50.35,83.73 v50.35,95.47 | v24.08,51.16 23.14,50.23 v21.23,50.23 | v7.58,48.56 5.57,46.56 5.57,41.05 4.88,40.36 3.29,40.36 v1.83,41.82
/FMEM1-CS
  Top 0.152: IC1.11 O6.P$1 T27.P$1 38.41,100.63 38.41,100.66 38.68,100.94 38.68,102.78 40.12,104.22 40.12,107.59 39.7,108.02 35.78,108.02 35.17,108.63 35.17,114 35.55,114.37 R25.1
  Top 0.254: IC9.1 R25.1
/MCLR  (via drill 0.3)
  Top 0.152: IC1.13 37.26,101.6 v36.98,101.88 | 28.58,103.86 30.14,105.42 v30.18,105.46 | J17.1 3.58,68.62 4.46,69.5 4.46,79.86 v4.12,79.86 | R90.2 10.01,95.68 v9.98,95.71
  Top 0.203: R90.2 11.29,96.41 11.66,96.77 15.24,96.77 15.62,97.16 15.62,99.59 19.58,103.56 28.27,103.56 30.14,105.42
  Bottom 0.152: v36.98,101.88 35.74,103.12 35.74,104.8 35.36,105.17 34.01,105.17 33.76,104.93 30.71,104.93 v30.18,105.46 | v9.98,95.71 7.15,92.88 2.69,92.88 2.29,92.47 2.29,81.46 3.89,79.86 v4.12,79.86
/NCS
  Top 0.152: IC1.23 32.26,99.74 32.66,100.14 O14.P$1
/VPS-PWRON  (via drill 0.3)
  Top 0.152: IC1.17 O9.P$1 T31.P$1 35.26,102.88 34.31,103.82 34.01,103.82 33.61,104.22 33.61,104.78 34.5,105.67 34.5,106.68 v35.11,107.29 | R107.2 4.07,92.2 v2.97,92.2
  Bottom 0.152: v2.97,92.2 13.03,92.2 16,95.17 16,101.42 20.8,106.22 30.71,106.22 31.65,105.28 33.1,105.28 v35.11,107.29
A0
  Top 0.152: IC2.20 14.93,70.17 21.32,63.77 IC3.12
A1
  Top 0.152: IC2.21 14.43,70.17 21.47,63.12 IC3.13
A2
  Top 0.152: IC2.22 13.93,70.17 21.62,62.47 IC3.14
A3
  Top 0.152: IC2.23 13.43,70.17 21.77,61.82 IC3.15
A4
  Top 0.152: IC2.24 12.93,70.17 21.92,61.17 IC3.16
A5
  Top 0.152: IC2.25 12.93,59.83 14.13,61.03 19.2,61.03 19.71,60.52 IC3.17
A6
  Top 0.152: IC2.45 22.93,59.41 23.38,59.87 IC3.18
A7
  Top 0.152: IC2.48 24.43,59.26 24.57,59.41 24.83,59.41 25.02,59.22 IC3.19
A8
  Top 0.152: IC2.19 15.43,70.17 19.27,66.32 IC4.19
A9
  Top 0.152: IC2.18 15.93,70.16 19.11,66.97 IC4.18
A10
  Top 0.152: IC2.17 16.43,70.16 18.96,67.62 IC4.17
A11
  Top 0.152: IC2.16 16.93,70.16 18.81,68.27 IC4.16
A12
  Top 0.152: IC2.9 20.43,73.12 24.62,68.92 IC4.15
A13
  Top 0.152: IC2.8 20.93,73.11 24.47,69.57 IC4.14
A14
  Top 0.152: IC2.7 21.43,73.11 24.31,70.22 IC4.13
A15
  Top 0.152: IC2.6 21.93,73.11 24.16,70.87 IC4.12
A16
  Top 0.152: IC2.5 22.42,78.03 22.42,78.85 22.11,79.16 22.11,84.28 20.33,86.06 20.33,89.38 21.42,90.47 21.42,91.98 23.53,94.09 25.11,94.09 25.25,94.24 IC1.32
A17
  Top 0.152: IC2.4 22.92,78.84 22.54,79.22 | 22.54,79.22 22.46,79.31 | 22.54,79.22 22.54,79.23 22.46,79.32 22.46,84.43 20.69,86.21 20.69,89.24 21.77,90.32 21.77,91.83 23.67,93.74 IC1.33
A18
  Top 0.152: IC2.3 23.43,78.85 23.18,79.1 | 23.18,79.1 23.17,79.1 23.13,79.14 | 23.18,79.1 22.81,79.46 22.81,84.58 21.04,86.35 21.04,89.09 22.12,90.18 22.12,91.69 23.67,93.24 IC1.34
A19
  Top 0.152: IC2.2 23.93,78.85 23.16,79.61 23.16,84.72 21.39,86.5 21.39,88.95 22.48,90.03 22.48,91.52 23.71,92.75 28.77,92.75 28.78,92.74 IC1.35 29.51,92.69
A20
  Top 0.152: IC2.1 24.43,78.97 23.52,79.88 23.52,89.02 24.24,89.74 IC1.41
A+  (1 unrouted)
  Bottom 0.61: J4.4 J3.4
A++
  Top 0.203: R109.2 R32.2 74.36,202.67 IC14.3 74.36,200.88 75.11,200.13 R34.2 75.14,197.59 75.74,197.59 76.21,198.05 IC12.6
AGND1
  Top 0.254: J1.2 17.61,38.71 17.39,38.93 16.39,38.93 15.3,40.02
  Top 0.305: C9.- 14.05,41.35 R6.1 14.11,40.02 15.3,40.02 C3.1
AGND2
  Top 0.254: J2.2 35.39,38.71 35.17,38.93 33.55,38.93 33.29,39.19 C4.1
  Top 0.61: C10.- 32.55,42.12 33.29,41.39 C4.1 33.25,40.07 R7.1
AVDD
  Top 0.152: IC1.30 26.98,95.24 26.73,95.48 25.89,95.48 C55.1
  Top 0.305: C55.1 25,94.59 22.29,94.59 21.27,93.58 20.6,93.58
  Top 0.406: 20.6,93.58 C56.+
  Top 0.508: R92.2 19.56,91.61 20.56,92.61 C56.+ 20.56,95.42 C88.1
AVDD1
  Top 0.254: C3.2 17.57,39.38 17.58,39.38 18.04,38.93 18.39,38.93 18.61,38.71 J1.4
  Top 0.61: C3.2 16.93,41.66 C9.+ 16.68,43.67 L1.2
AVDD2
  Top 0.254: J2.4 36.39,38.71 36.17,38.93 35.82,38.93 34.86,39.88 C4.2
  Top 0.61: C4.2 34.86,41.9 C10.+ 34.64,43.95 L2.1
B-  (1 unrouted)
  Bottom 0.61: J3.5 J4.5
B--
  Top 0.203: R31.1 R32.1 | R32.1 73.41,204.62 R108.2 | R32.1 73.41,200.99 74.36,200.04 IC14.2 74.36,198.19 74.2,198.03 74.2,197.21 74.58,196.82 76.92,196.82 IC12.7
BT-RTS  (via drill 0.3)  (1 unrouted)
  Top 0.152: IC1.83 O32.P$1 T44.P$1 46.61,88.22 49.73,85.11 49.73,84.73 49.73,84.62 49.73,82.94 50.05,82.61 50.98,82.61 51.6,81.99 51.97,81.99 52.87,82.89 v52.87,83.07 | v37.28,128.77 35.6,130.44 35.6,158.8
  Bottom 0.152: J13.7 28.23,165.17 27.28,166.12 27.28,171.98 26.03,173.23 J14.7 | v52.87,83.07 52.87,80.94 53.25,80.56 56.74,80.56 57.94,81.76 57.94,86.83 57.38,87.39 57.38,88.6 60.64,91.86 60.64,110.59 59.67,111.56 59.67,112.77 53.84,118.6 53.84,118.64 52.1,120.37 52.1,126.72 50.37,128.44 37.6,128.44 v37.28,128.77
BT-RX  (via drill 0.3)  (1 unrouted)
  Top 0.152: IC1.73 42.26,82.5 42.82,81.94 O37.P$1 T40.P$1 44.54,81.94 45.12,81.36 45.12,79.87 v44.48,79.22 | v51.74,111.78 51.74,111.82 51.04,112.52 51.04,113.97 48.53,116.48 47.24,116.48 42.21,121.51 42.13,121.51 34.55,129.09 34.55,161.24
  Bottom 0.152: J13.3 25,181.02 J14.3 | v44.48,79.22 44.8,78.9 44.8,78.88 45.2,78.48 45.76,78.48 46.15,78.88 46.15,86.58 49.3,89.72 49.3,94.53 48.95,94.88 48.95,96.05 49.37,96.46 49.37,98 50.07,98.7 50.24,98.7 53.83,102.29 53.83,103.77 52.87,104.73 52.58,104.73 51.31,106 51.31,110.17 50.99,110.5 50.99,111.06 51.38,111.45 51.42,111.45 v51.74,111.78
BT-TX  (via drill 0.3)
  Top 0.152: IC1.74 42.76,82.5 42.93,82.34 O36.P$1 T41.P$1 44.64,82.34 45.48,81.5 v45.48,79.16 | J13.4 32.5,177.05 34.9,174.65 34.9,129.24 42.27,121.86 42.35,121.86 47.39,116.83 48.67,116.83 51.39,114.11 51.39,113.65 51.74,113.31 v51.74,112.78
  Bottom 0.152: J13.4 25.38,177.05 24.06,178.37 24.06,180.53 23.75,180.85 J14.4 | v51.74,112.78 v51.75,112.77 51.75,112.74 51.06,112.06 51.06,111.63 50.63,111.2 50.63,110.35 50.96,110.03 50.96,105.85 52.44,104.38 52.72,104.38 53.47,103.62 53.47,102.44 50.09,99.06 49.92,99.06 49.01,98.15 49.01,96.61 48.6,96.19 48.6,94.74 48.95,94.39 48.95,89.87 45.8,86.72 45.8,79.48 v45.48,79.16
CON-LED  (via drill 0.3)  (1 unrouted)
  Top 0.152: IC1.78 45.76,86.24 O33.P$1 T43.P$1 47.62,84.37 v47.62,83.23 | v50.7,81.93 51.02,81.61 52.37,81.61 53.56,82.8 53.56,89.7 v53.42,89.85 | v35.58,129.51 35.25,129.84 35.25,160.32
  Bottom 0.152: J13.6 28.38,169.13 27.63,169.88 27.63,172.13 23.99,175.77 J14.6 | v47.62,83.23 49.41,83.23 v50.7,81.93 | v53.42,89.85 53.91,90.34 54.41,90.34 56.34,92.28 56.34,94.74 55.08,96.01 55.08,97.57 57.42,99.92 57.42,102.23 56.65,103 56.65,104.96 54.53,107.08 54.53,116.48 53.48,117.53 53.48,118.49 51.75,120.23 51.75,126.57 50.22,128.09 37,128.09 v35.58,129.51
CS-SRAM  (via drill 0.35)
  Top 0.152: IC1.38 O17.P$1 T28.P$1 26.93,91.24 26.67,90.97 23.91,90.97 21.74,88.8 21.74,87.79 22.09,87.44 22.09,86.87 22.8,86.17 v22.8,86.08 | IC2.12 R5.2 v18.92,82.65
  Bottom 0.152: v22.8,86.08 19.37,82.65 v18.92,82.65
CURR-SENSE  (1 unrouted)
  Top 0.152: C66.1 37.15,103.48 36.11,102.45 36.11,101.53 36.75,100.89 T39.P$1 O8.P$1 IC1.14
D0  (via drill 0.3, 0.35)
  Top 0.152: IC2.29 14.92,57.52 17.8,54.64 33.21,54.64 37.32,58.75 37.32,60.05 37.64,60.37 37.64,61.83 37.26,62.2 37.26,62.66 36.45,63.47 35.94,63.47 35.59,63.82 34.84,63.82 34.61,64.05 34.05,64.05 33.83,63.83 v33.37,63.83 33.32,63.77 IC3.9 30.58,63.77 30.37,63.98 30.37,66.1 30.6,66.32 IC4.2 | IC1.93 46.33,93.74 46.99,94.39 48.18,94.39 48.2,94.41 54.05,94.41 54.33,94.7 54.89,94.7 55.44,94.15 55.44,90.91 53.91,89.39 53.91,82.65 52.51,81.26 49.21,81.26 47.56,79.61 47.56,66.71 43.37,62.52 42.8,62.52 42.51,62.8 41.35,62.8 41.07,63.09 40.01,63.09 v39.91,63.19
  Bottom 0.152: v33.37,63.83 33.83,63.83 34.05,64.05 39.05,64.05 v39.91,63.19
D1  (via drill 0.3, 0.35)
  Top 0.152: IC2.31 15.94,57.76 18.71,54.99 33.06,54.99 36.96,58.9 36.96,60.2 37.28,60.52 37.28,61.68 36.91,62.06 36.91,62.52 36.3,63.12 35.8,63.12 35.45,63.47 34.88,63.47 34.79,63.37 v34.33,63.37 34.08,63.12 IC3.8 30.25,63.12 30.02,63.35 30.02,66.64 30.36,66.97 IC4.3 | IC1.94 46.34,94.24 46.84,94.74 48.03,94.74 48.06,94.77 53.9,94.77 54.19,95.05 55.04,95.05 55.79,94.3 55.79,90.76 54.26,89.24 54.26,82.51 52.66,80.91 49.36,80.91 47.91,79.46 47.91,66.57 43.51,62.16 42.65,62.16 42.37,62.45 41.33,62.45 41.27,62.39 v40.78,62.39
  Bottom 0.152: v34.33,63.37 34.79,63.37 34.88,63.47 38.64,63.47 39.72,62.39 v40.78,62.39
D2  (via drill 0.3, 0.35)
  Top 0.152: IC2.33 16.93,57.66 19.24,55.34 32.91,55.34 36.61,59.04 36.61,60.34 36.93,60.66 36.93,61.53 36.55,61.91 36.55,62.37 36.16,62.77 35.19,62.77 v35.16,62.79 34.83,62.46 IC3.7 29.91,62.47 29.67,62.72 29.67,67.29 30,67.62 IC4.4 | v40.72,61.34 41.48,62.1 42.06,62.1 42.35,61.81 43.66,61.81 48.27,66.42 48.27,79.31 49.5,80.55 52.81,80.55 54.62,82.36 54.62,89.09 56.14,90.62 56.14,94.45 55.18,95.4 51.77,95.4 51.12,96.05 51.12,97.86 50.71,98.27 50.13,98.27 49.72,97.86 49.72,97.31 48.85,96.43 46.24,96.43 46.04,96.24 IC1.98
  Bottom 0.152: v40.72,61.34 40.72,61.32 40,62.04 39.58,62.04 38.82,62.79 v35.16,62.79
D3  (via drill 0.3, 0.35)
  Top 0.152: IC2.35 17.93,57.68 19.91,55.7 32.77,55.7 36.26,59.19 36.26,60.49 36.58,60.81 36.58,61.39 v35.88,62.09 35.61,61.82 IC3.6 29.7,61.82 29.32,62.21 29.32,67.92 29.67,68.27 IC4.5 | v41.77,61.4 41.83,61.46 43.8,61.46 48.62,66.27 48.62,79.17 49.65,80.2 52.95,80.2 54.97,82.22 54.97,88.95 56.49,90.47 56.49,94.59 55.33,95.76 53.89,95.76 | IC1.99 46.04,96.74 46.09,96.79 48.7,96.79 49.37,97.45 49.37,98 49.98,98.62 50.85,98.62 51.47,98 51.47,96.2 51.91,95.76 53.89,95.76 | 53.89,95.76
  Bottom 0.152: v41.77,61.4 41.01,60.64 40.43,60.64 38.98,62.09 v35.88,62.09
D4  (via drill 0.3, 0.35)
  Top 0.152: IC2.38 19.43,57.7 21.08,56.05 32.62,56.05 35.9,59.33 v35.9,61.09 35.82,61.17 IC3.5 29.36,61.17 28.96,61.57 28.96,68.56 29.33,68.92 IC4.6 | v41.71,60.35 42.47,61.11 43.05,61.11 43.34,60.82 43.66,60.82 48.97,66.13 48.97,79.02 49.8,79.85 53.1,79.85 55.32,82.07 55.32,88.8 56.84,90.33 56.84,94.74 55.48,96.11 52.06,96.11 51.83,96.34 51.83,98.15 51,98.97 49.84,98.97 49.01,98.15 49.01,97.6 48.55,97.14 46.1,97.14 46,97.24 IC1.100
  Bottom 0.152: v41.71,60.35 41.22,60.35 41.16,60.28 40.28,60.28 39.48,61.09 v35.9,61.09
D5  (via drill 0.3, 0.35)
  Top 0.152: IC2.40 20.43,57.72 21.74,56.4 32.48,56.4 35.2,59.12 v35.2,60.38 35.05,60.52 IC3.4 29.15,60.52 28.61,61.06 28.61,69.06 29.12,69.57 IC4.7 | IC1.3 42.26,102.37 44.26,104.37 48.45,104.37 52.51,100.31 52.51,99.57 57.2,94.88 57.2,90.18 55.67,88.66 55.67,81.92 53.24,79.5 49.94,79.5 49.32,78.88 49.32,65.98 43.81,60.47 42.82,60.47 v42.76,60.41
  Bottom 0.152: v42.76,60.41 42,59.65 41.42,59.65 41.13,59.93 40.14,59.93 39.69,60.38 v35.2,60.38
D6  (via drill 0.3, 0.35)
  Top 0.152: IC2.42 21.43,57.74 22.41,56.76 32.33,56.76 34.43,58.85 v34.43,59.74 34.29,59.87 IC3.3 28.94,59.87 28.26,60.56 28.26,69.57 28.91,70.22 IC4.8 | IC1.4 41.76,102.37 44.11,104.72 48.6,104.72 | 48.6,104.72 48.61,104.72 | v42.7,59.35 43.46,60.11 43.95,60.11 49.68,65.84 49.68,78.73 50.09,79.14 53.39,79.14 56.03,81.78 56.03,88.51 57.55,90.03 57.55,95.03 52.87,99.71 52.87,100.45 48.6,104.72
  Bottom 0.152: v42.7,59.35 42.6,59.25 35.37,59.25 34.88,59.74 v34.43,59.74
D7  (via drill 0.3, 0.35)
  Top 0.152: IC2.44 22.43,57.62 22.94,57.11 32.18,57.11 33.59,58.52 v33.59,59.16 33.53,59.22 IC3.2 28.57,59.22 27.91,59.89 27.91,70.01 28.77,70.87 IC4.9 | IC1.5 41.26,102.37 43.97,105.08 48.75,105.08 48.96,104.87 48.96,104.86 53.83,99.99 53.83,99.25 57.9,95.18 57.9,89.89 56.38,88.36 56.38,81.63 53.54,78.79 50.23,78.79 50.03,78.58 50.03,65.69 v43.75,59.41
  Bottom 0.152: v43.75,59.41 42.99,58.65 41.75,58.65 41.5,58.9 34.31,58.9 34.05,59.16 v33.59,59.16
D_N  (via drill 0.3)
  Top 0.152: IC1.56 33.76,84.41 33.84,84.49 33.84,85.23 39.14,90.54 39.14,93.22 44.85,98.93 47,98.93 v47,99.25 | v49.12,119.97 49.45,119.97 49.45,120.45 48.39,121.51 IC15.2 49.47,122.08 49.92,122.52 49.92,122.53 50.08,122.7 51.5,122.7 51.73,122.46 53.23,122.46 53.62,122.08 54.62,121.07 54.81,120.88 56.62,120.88 56.88,121.14 56.88,121.41 J12.2_D-
  Bottom 0.152: v47,99.25 47,98.93 47.94,98.93 48.47,99.46 48.47,116.32 49.45,117.3 49.45,119.97 v49.12,119.97
D_P  (via drill 0.3)
  Top 0.152: IC1.57 34.26,84.42 34.19,84.49 34.19,85.09 34.41,85.31 arc-90 34.66,85.31 arc90 34.91,85.31 35.45,85.85 arc90 35.45,86.1 arc-90 35.45,86.35 39.49,90.39 39.49,93.07 45,98.58 47,98.58 v47,98.25 | v50.12,119.97 49.8,119.97 49.8,120.45 50.79,121.44 IC15.3 50.82,122.11 53.08,122.11 53.37,121.83 arc-90 53.37,121.58 53.12,121.33 arc90 53.12,121.09 53.13,121.08 arc90 53.38,121.08 53.62,121.33 arc-90 53.87,121.33 53.87,121.32 arc-90 53.87,121.07 53.63,120.83 arc90 53.63,120.58 53.63,120.58 arc90 53.88,120.58 54.12,120.82 arc-90 54.37,120.82 54.67,120.53 56.77,120.53 57.23,120.99 57.23,121.44 J12.3_D+
  Bottom 0.152: v47,98.25 47,98.58 48.09,98.58 48.82,99.31 48.82,116.18 49.8,117.15 49.8,119.97 v50.12,119.97
DGND  (via drill 0.3, 0.35, 0.41)  (64 unrouted)
  Top 0.152: v23.18,91.23 23.79,91.84 C49.2 | C48.2 v25.46,84.56 | IC2.14 17.93,79.52 v17.91,79.54 | IC2.15 17.4,78.05 v17.4,79.54 | R5.1 17.33,82.45 v17.34,82.46 | R2.1 26.78,76.37 v25.72,76.37 | R1.1 30.93,75.51 v30.75,75.69 | C2.2 29.33,75.36 v29.65,75.69 | IC4.10 31.83,72.06 v32.06,72.29 | IC1.65 38.26,85.03 v38.23,85.07 | IC1.75 43.26,85.05 v43.24,85.07 | D5.K 58.97,103.79 v59.01,103.75 | IC1.15 36.27,98.92 v36.27,97.54 | C27.2 46.55,112.68 v46.57,112.65 | IC9.4 39.66,110.56 v39.69,110.58 | IC2.47 23.93,57.52 23.96,57.48 23.65,57.48 23.43,57.71 IC2.46 | 30.48,58.57 30.45,58.55 v30.19,58.55 | C1.2 51.4,64.97 v51.36,65.01 | C47.2 37.28,76.14 v37.26,76.12 | IC13.3 21.36,98.47 v21.34,98.45
  Top 0.203: IC1.36 v30.92,92.24 | IC3.1 30.48,58.57 30.19,58.57 | IC4.1 32.6,65.67 v33.15,65.13 33.15,64.94 32.63,64.42 IC3.10 | C87.- 34.53,65.21 v34.54,65.19 | 60.24,66.82 IC7.1 57.37,66.82 56.72,67.47 IC7.7 53.95,67.47 v53.66,67.18 | 60.24,66.82 60.39,66.97 60.39,67.48 | 60.39,67.48 60.39,68.18 | 60.39,68.18 60.39,68.62 60.24,68.77 IC7.4 | IC7.3 60.33,68.12 60.39,68.18 | IC7.2 60.38,67.47 60.39,67.48 | C28.2 60.15,70.37 v60.19,70.33 | IC11.1 60.15,72.07 | 60.33,73.32 60.33,72.24 60.15,72.07 | 60.33,73.32 60.33,73.83 60.14,74.02 IC11.4 | IC11.3 59.45,73.32 60.33,73.32 | 60.15,72.07 60.33,71.89 v60.33,71.48 | 60.24,66.82 60.39,66.67 v60.39,66.14 | 14.38,60.16 v15.87,60.16 | 14.38,60.16 13.93,59.71 IC2.27 13.93,56.97 14.02,56.88 13.78,56.63 v13.47,56.63 13.43,56.68 IC2.26 13.43,59.8 13.79,60.16 14.38,60.16 | 23.96,57.48 29.1,57.48 | Q10.4 81.86,210.78 81.9,210.74 81.9,209.28 81.11,208.48
  Top 0.254: C14.- 36.79,44.78 v36.76,44.81 | C12.- 42.28,44.77 v42.24,44.81 | C11.- 23.98,44.66 v23.96,44.68 | C7.1 20.66,41.51 C5.2 22.6,42 v23.29,42 | C13.- 18.75,44.84 v18.78,44.87 | C75.2 29.69,43.28 v29.69,44.38 | R7.2 29.24,40.07 v29.2,40.11 | R46.1 140.61,186.82 v140.66,186.77 | C35.2 139.37,188.04 v139.37,186.77 | IC6.2 139.73,190.52 139.52,190.73 v139.52,192.1 | C38.2 86.61,202.72 | 86.61,202.72 v86.56,202.77 | R88.2 86.01,202.11 86.61,202.72 | Q12.4 86.61,202.76 86.61,202.72 | R86.2 89.16,205.66 v90.22,205.66 | R59.2 72.78,219.22 v72.77,219.23 | R60.2 72.71,217.72 v72.69,217.7 | R57.1 75.01,210.11 v74.98,210.08 | R58.2 76.61,210.13 v76.66,210.08 | R83.2 81.11,208.48 81.11,207.45 v81.08,207.42 | R80.2 82.71,207.52 v82.68,207.49 | C37.2 84.12,208.55 v84.12,207.42
  Top 0.279: IC8.EP 133.91,199.92 IC8.10 132.71,199.14 v132.89,198.96 | R17.2 134.41,198.8 v134.42,198.81 | C24.1 131.62,197.73 v131.68,197.67
  Top 0.305: C51.2 47.56,103.02 v47.56,101.83 | C53.2 51.38,87.1 v52.45,87.1 | C54.- 52.06,90.67 v52.01,90.72 | C52.2 50.89,90.94 v51.5,91.54 | C36.2 C64.2 24.27,101.92 v24.26,101.92 | C57.2 C55.2 23.25,95.44 v23.23,95.46 22.17,95.46 C88.2 | C58.2 17.92,97.45 | 17.92,97.45 C59.2 | 17.92,97.45 v17.92,96.38 | C56.- 17.36,95.14 v17.37,95.16 | C50.2 35.53,106.05 36.33,106.05 | 36.33,106.05 C66.2 37.98,106.05 | 37.98,106.05 C65.2 | 37.98,106.05 v37.98,107.17 | 36.33,106.05 v36.33,107.17 | Q3.1 4.8,28.09 5.17,28.46 R112.2 | C76.2 v11.03,35.42 | v11.03,35.42 | R6.2 11.52,39.95 v11.16,40.32 | IC12.5 78.65,199.32 v78.72,199.26 | C86.- 73.26,191.92 v73.23,191.95 | C41.2 75.33,193.82 v75.29,193.78 | R71.2 83.13,192.29 v83.13,191.26 | IC10.2 v85.2,192.02 v85.19,192.02 | IC10.1 85.22,192.97 v85.19,192.94 | C29.2 97.21,189.72 v97.46,189.97 | R43.1 R48.1 | R48.1 R44.2 | R40.1 112.29,177.52 112.09,177.32 112.09,176.94 111.97,176.82 R48.1 | R41.2 113.19,181.2 v114.38,181.2 | L12.1 107.5,184.62 v106.91,184.02 | C77.2 v87.7,215.42 v87.71,215.42 | C78.2 86.14,217.17 v87.4,217.17 | IC14.1 71.61,199.32 v71.25,198.96 70.81,199.4 C39.2 | R31.2 69.36,203.32 v69.34,203.3
  Top 0.356: Q14.1 54.22,24.24 53.83,24.63 R118.2
  Top 0.381: IC16.4 122.26,189.31 v122.22,189.28